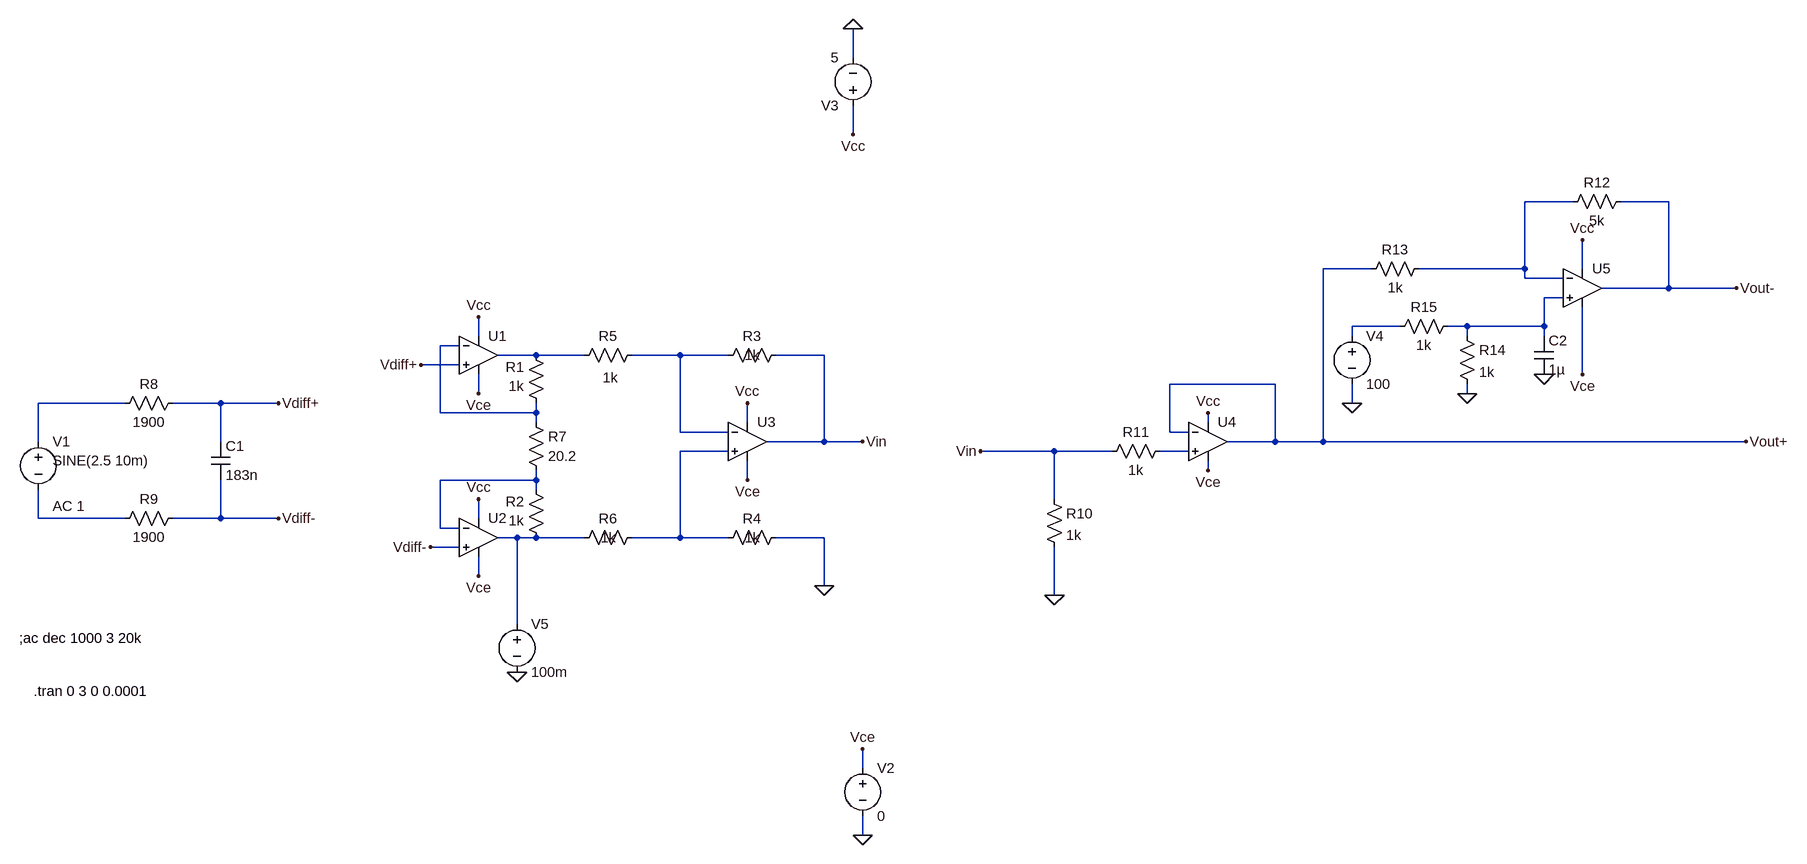
[diagram p0: schematic Diff-amp-3.asc]
Diff-amp-3.asc, the LTspice schematic file:
Version 4
SHEET 1 3924 1592
WIRE 960 -496 960 -544
WIRE 960 -368 960 -416
WIRE 2448 -256 2368 -256
WIRE 2608 -256 2528 -256
WIRE 2112 -144 2032 -144
WIRE 2368 -144 2368 -256
WIRE 2368 -144 2192 -144
WIRE 2464 -144 2464 -192
WIRE 2368 -128 2368 -144
WIRE 2432 -128 2368 -128
WIRE 2608 -112 2608 -256
WIRE 2608 -112 2496 -112
WIRE 2736 -112 2608 -112
WIRE 2432 -96 2400 -96
WIRE 2160 -48 2080 -48
WIRE 2272 -48 2240 -48
WIRE 2400 -48 2400 -96
WIRE 2400 -48 2272 -48
WIRE 336 -32 336 -64
WIRE 2080 -32 2080 -48
WIRE 2272 -32 2272 -48
WIRE 2400 -32 2400 -48
WIRE 304 -16 272 -16
WIRE 432 0 368 0
WIRE 512 0 432 0
WIRE 672 0 592 0
WIRE 752 0 672 0
WIRE 912 0 832 0
WIRE 304 16 240 16
WIRE 2464 32 2464 -80
WIRE 1952 48 1776 48
WIRE 336 64 336 32
WIRE 2272 64 2272 48
WIRE -352 80 -496 80
WIRE -192 80 -272 80
WIRE -96 80 -192 80
WIRE 2080 80 2080 48
WIRE 272 96 272 -16
WIRE 432 96 432 80
WIRE 432 96 272 96
WIRE 432 112 432 96
WIRE 784 112 784 80
WIRE 1840 112 1840 96
WIRE 672 128 672 0
WIRE 752 128 672 128
WIRE 1776 128 1776 48
WIRE 1808 128 1776 128
WIRE -496 144 -496 80
WIRE -192 144 -192 80
WIRE 912 144 912 0
WIRE 912 144 816 144
WIRE 976 144 912 144
WIRE 1952 144 1952 48
WIRE 1952 144 1872 144
WIRE 2032 144 2032 -144
WIRE 2032 144 1952 144
WIRE 2752 144 2032 144
WIRE 752 160 672 160
WIRE 1584 160 1456 160
WIRE 1680 160 1584 160
WIRE 1808 160 1760 160
WIRE 1840 192 1840 176
WIRE 432 208 432 192
WIRE 432 208 272 208
WIRE 784 208 784 176
WIRE 432 224 432 208
WIRE 1584 240 1584 160
WIRE -496 272 -496 224
WIRE -352 272 -496 272
WIRE -192 272 -192 208
WIRE -192 272 -272 272
WIRE -96 272 -192 272
WIRE 336 272 336 240
WIRE 272 288 272 208
WIRE 304 288 272 288
WIRE 400 304 368 304
WIRE 432 304 400 304
WIRE 512 304 432 304
WIRE 672 304 672 160
WIRE 672 304 592 304
WIRE 752 304 672 304
WIRE 912 304 832 304
WIRE 304 320 256 320
WIRE 336 368 336 336
WIRE 912 384 912 304
WIRE 1584 400 1584 320
WIRE 400 448 400 304
WIRE 976 688 976 656
WIRE 976 800 976 768
FLAG 912 384 0
FLAG 256 320 Vdiff-
FLAG 336 240 Vcc
FLAG 784 80 Vcc
FLAG 336 368 Vce
FLAG 336 64 Vce
FLAG 784 208 Vce
FLAG 336 -64 Vcc
FLAG 240 16 Vdiff+
FLAG 976 144 Vin
FLAG -96 80 Vdiff+
FLAG -96 272 Vdiff-
FLAG 976 800 0
FLAG 976 656 Vce
FLAG 960 -544 0
FLAG 960 -368 Vcc
FLAG 1584 400 0
FLAG 1840 96 Vcc
FLAG 1840 192 Vce
FLAG 2464 -192 Vcc
FLAG 2400 32 0
FLAG 2272 64 0
FLAG 2464 32 Vce
FLAG 2736 -112 Vout-
FLAG 2752 144 Vout+
FLAG 2080 80 0
FLAG 400 528 0
FLAG 1456 160 Vin
SYMBOL res 448 96 R180
WINDOW 0 36 76 Left 2
WINDOW 3 36 44 Left 2
SYMATTR InstName R1
SYMATTR Value 1k
SYMBOL res 448 320 R180
WINDOW 0 36 76 Left 2
WINDOW 3 36 44 Left 2
SYMATTR InstName R2
SYMATTR Value 1k
SYMBOL res 848 -16 R90
WINDOW 0 0 56 VBottom 2
WINDOW 3 32 56 VBottom 2
SYMATTR InstName R3
SYMATTR Value 1k
SYMBOL res 848 288 R90
WINDOW 0 0 56 VBottom 2
WINDOW 3 32 56 VBottom 2
SYMATTR InstName R4
SYMATTR Value 1k
SYMBOL res 608 -16 R90
WINDOW 0 0 56 VBottom 2
WINDOW 3 69 52 VBottom 2
SYMATTR InstName R5
SYMATTR Value 1k
SYMBOL res 608 288 R90
WINDOW 0 0 56 VBottom 2
WINDOW 3 32 56 VBottom 2
SYMATTR InstName R6
SYMATTR Value 1k
SYMBOL res 416 96 R0
WINDOW 3 36 72 Left 2
SYMATTR Value 20.2
SYMATTR InstName R7
SYMBOL res -256 64 R90
WINDOW 0 0 56 VBottom 2
WINDOW 3 32 56 VTop 2
SYMATTR InstName R8
SYMATTR Value 1900
SYMBOL cap -208 144 R0
SYMATTR InstName C1
SYMATTR Value 183n
SYMBOL res -256 256 R90
WINDOW 0 0 56 VBottom 2
WINDOW 3 32 56 VTop 2
SYMATTR InstName R9
SYMATTR Value 1900
SYMBOL voltage -496 128 R0
WINDOW 123 24 124 Left 2
WINDOW 39 0 0 Left 0
WINDOW 3 24 48 Left 2
SYMATTR Value2 AC 1
SYMATTR Value SINE(2.5 10m)
SYMATTR InstName V1
SYMBOL voltage 976 672 R0
WINDOW 123 0 0 Left 0
WINDOW 39 0 0 Left 0
SYMATTR InstName V2
SYMATTR Value 0
SYMBOL voltage 960 -400 R180
WINDOW 123 0 0 Left 0
WINDOW 39 0 0 Left 0
SYMATTR InstName V3
SYMATTR Value 5
SYMBOL OpAmps\\UniversalOpAmp 336 0 R0
SYMATTR InstName U1
SYMBOL OpAmps\\UniversalOpAmp 336 304 R0
SYMATTR InstName U2
SYMBOL OpAmps\\UniversalOpAmp 784 144 R0
SYMATTR InstName U3
SYMBOL res 1568 224 R0
SYMATTR InstName R10
SYMATTR Value 1k
SYMBOL res 1776 144 R90
WINDOW 0 0 56 VBottom 2
WINDOW 3 32 56 VTop 2
SYMATTR InstName R11
SYMATTR Value 1k
SYMBOL OpAmps\\UniversalOpAmp 1840 144 R0
SYMATTR InstName U4
SYMBOL OpAmps\\UniversalOpAmp 2464 -112 R0
SYMATTR InstName U5
SYMBOL res 2544 -272 R90
WINDOW 0 0 56 VBottom 2
WINDOW 3 32 56 VTop 2
SYMATTR InstName R12
SYMATTR Value 5k
SYMBOL res 2208 -160 R90
WINDOW 0 0 56 VBottom 2
WINDOW 3 32 56 VTop 2
SYMATTR InstName R13
SYMATTR Value 1k
SYMBOL res 2256 -48 R0
SYMATTR InstName R14
SYMATTR Value 1k
SYMBOL cap 2384 -32 R0
SYMATTR InstName C2
SYMATTR Value 1µ
SYMBOL res 2256 -64 R90
WINDOW 0 0 56 VBottom 2
WINDOW 3 32 56 VTop 2
SYMATTR InstName R15
SYMATTR Value 1k
SYMBOL voltage 2080 -48 R0
WINDOW 123 0 0 Left 0
WINDOW 39 0 0 Left 0
SYMATTR InstName V4
SYMATTR Value 100
SYMBOL voltage 400 432 R0
WINDOW 123 0 0 Left 0
WINDOW 39 0 0 Left 0
SYMATTR InstName V5
SYMATTR Value 100m
TEXT -528 472 Left 2 !;ac dec 1000 3 20k
TEXT -504 560 Left 2 !.tran 0 3 0 0.0001

The netlist it stands for:
* Diff-amp-3.asc
R1 N004 N005 1k
R2 N012 N010 1k
R3 Vin N006 1k
R4 0 N008 1k
R5 N006 N005 1k
R6 N008 N012 1k
R7 N004 N010 20.2
R8 Vdiff+ N007 1900
C1 Vdiff+ Vdiff- 183n
R9 Vdiff- N011 1900
V1 N007 N011 SINE(2.5 10m) AC 1
V2 Vce 0 0
V3 Vcc 0 5
XU1 Vdiff+ N004 Vcc Vce N005 level1 Avol=1Meg GBW=10Meg Vos=0 En=0 Enk=0 In=0 Ink=0 Rin=500Meg  ; pins In+ In- V+ V- OUT
XU2 Vdiff- N010 Vcc Vce N012 level1 Avol=1Meg GBW=10Meg Vos=0 En=0 Enk=0 In=0 Ink=0 Rin=500Meg  ; pins In+ In- V+ V- OUT
XU3 N008 N006 Vcc Vce Vin level1 Avol=1Meg GBW=10Meg Vos=0 En=0 Enk=0 In=0 Ink=0 Rin=500Meg  ; pins In+ In- V+ V- OUT
R10 Vin 0 1k
R11 N009 Vin 1k
XU4 N009 Vout+ Vcc Vce Vout+ level1 Avol=1Meg GBW=10Meg Vos=0 En=0 Enk=0 In=0 Ink=0 Rin=500Meg  ; pins In+ In- V+ V- OUT
XU5 N002 N001 Vcc Vce Vout- level1 Avol=1Meg GBW=10Meg Vos=0 En=0 Enk=0 In=0 Ink=0 Rin=500Meg  ; pins In+ In- V+ V- OUT
R12 Vout- N001 5k
R13 N001 Vout+ 1k
R14 N002 0 1k
C2 N002 0 1µ
R15 N002 N003 1k
V4 N003 0 100
V5 N012 0 100m
;ac dec 1000 3 20k
.tran 0 3 0 0.0001
.lib UniversalOpAmp1.lib
.backanno
.end